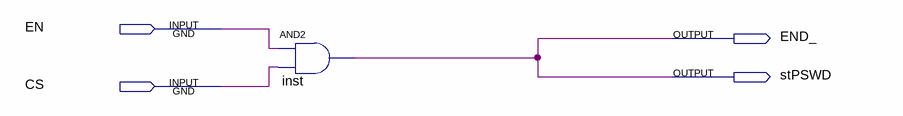
[diagram p0: schematic sheet]
// Quartus schematic SED.bdf as structural Verilog: 1 symbols, 4 pins
module SED (
  input  EN,
  input  CS,
  output END_,
  output stPSWD
);

  and inst (END_, EN, CS);

  assign stPSWD = END_;
endmodule
